# Altium schematic sheet SD&Smart Card.SchDoc
size A4; Revision: B.1(PCB.SCH)
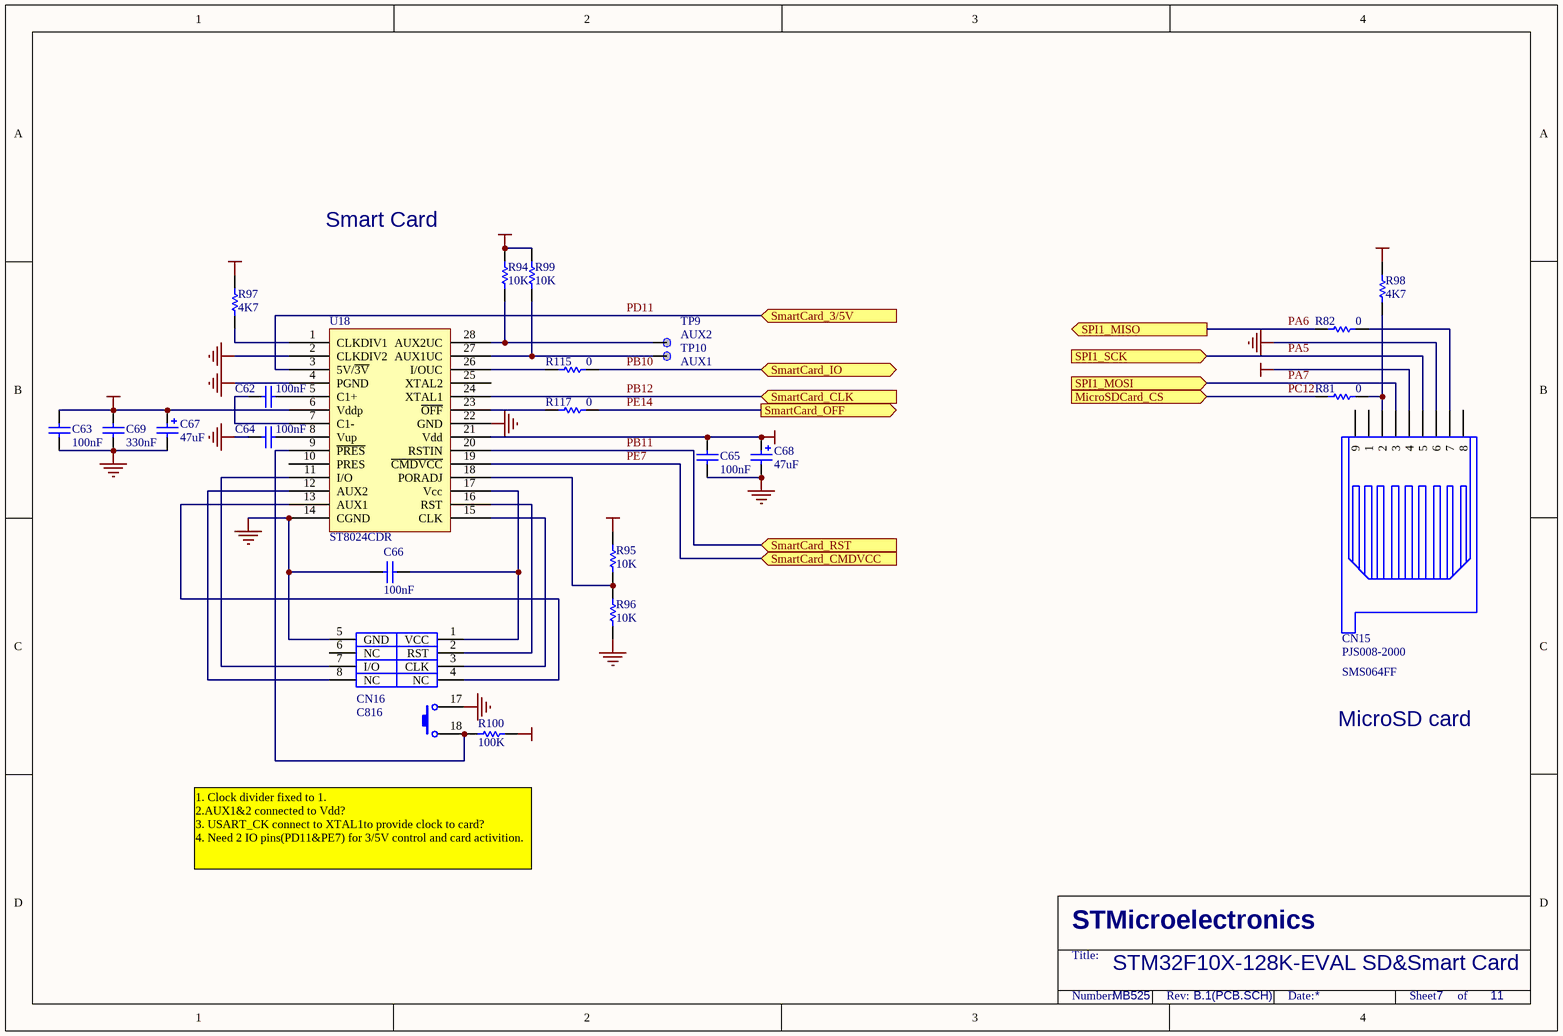
[diagram p0: SD&Smart Card.SchDoc]

## Parts
C62  100nF  [0603P]
C63  100nF  [0603P]
C64  100nF  [0603P]
C65  100nF  [0603P]
C66  100nF  [0603P]
C67  47uF  [TAN-B]
C68  47uF  [TAN-B]
C69  330nF  [0603]
CN15  PJS008-2000  [MSD(PJS008)]
CN16  C816  [SAM(C816)]
R81  0  [0805]
R82  0  [0805]
R94  10K  [0603]
R95  10K  [0603]
R96  10K  [0603]
R97  4K7  [0603]
R98  4K7  [0603]
R99  10K  [0603]
R100  100K  [0603]
R115  0  [0805]
R117  0  [0805]
TP9  AUX2  [TP]
TP10  AUX1  [TP]
U18  ST8024CDR  [SO28]

## Ports
MicroSDCard_CS (in), SmartCard_3/5V (in), SmartCard_CLK (in), SmartCard_CMDVCC (in), SmartCard_IO (bidir), SmartCard_OFF (out), SmartCard_RST (in), SPI1_MISO (out), SPI1_MOSI (in), SPI1_SCK (in)

## Nets
+3V3: C65.1 C68.1 CN15.4 R94.1 R95.1 R97.1 R98.2 R99.1 R100.1 U18.21(Vdd)
+5V: C63.1 C67.1 C69.1 U18.6(Vddp)
GND: C63.2 C64.2 C65.2 C66.1 C67.2 C68.2 C69.2 CN15.6 CN16.5(GND) CN16.17 R96.2 U18.2(CLKDIV2) U18.4(PGND) U18.14(CGND) U18.22(GND)
PA5: CN15.5 ; port SPI1_SCK
PA6: R82.1 ; port SPI1_MISO
PA7: CN15.3 ; port SPI1_MOSI
PB10: R115.2 ; port SmartCard_IO
PB11: U18.20(RSTIN) ; port SmartCard_RST
PB12: U18.24(XTAL1) ; port SmartCard_CLK
PC12: R81.2 ; port MicroSDCard_CS
PD11: U18.3(5V/~{3V}) ; port SmartCard_3/5V
PE7: U18.19(~{CMDVCC}) ; port SmartCard_CMDVCC
PE14: R117.1 ; port SmartCard_OFF
NetC62_1: C62.1 U18.7(C1-)
NetC62_2: C62.2 U18.5(C1+)
NetC64_1: C64.1 U18.8(Vup)
NetC66_2: C66.2 CN16.1(VCC) U18.17(Vcc)
NetCN15_2: CN15.2 R81.1 R98.1
NetCN15_7: CN15.7 R82.2
NetCN16_2: CN16.2(RST) U18.16(RST)
NetCN16_3: CN16.3(CLK) U18.15(CLK)
NetCN16_4: CN16.4(NC) U18.13(AUX1)
NetCN16_7: CN16.7(I/O) U18.11(I/O)
NetCN16_8: CN16.8(NC) U18.12(AUX2)
NetCN16_18: CN16.18 R100.2 U18.9(~{PRES})
NetR94_2: R94.2 TP9.1 U18.28(AUX2UC)
NetR95_2: R95.2 R96.1 U18.18(PORADJ)
NetR97_2: R97.2 U18.1(CLKDIV1)
NetR99_2: R99.2 TP10.1 U18.27(AUX1UC)
NetR115_1: R115.1 U18.26(I/OUC)
NetR117_2: R117.2 U18.23(~{OFF})

Not connected (* = marked no-connect by the designer): CN15 1 8 9; CN16 6(NC); U18 10(PRES) 25(XTAL2)

## Notes on the sheet
- Smart Card
- SMS064FF
- MicroSD card
- 1. Clock divider fixed to 1.
  2.AUX1&2 connected to Vdd?
  3. USART_CK connect to XTAL1to provide clock to card?
  4. Need 2 IO pins(PD11&PE7) for 3/5V control and card activition.
- STM32F10X-128K-EVAL SD&Smart Card
- MB525
- 7
- 11
- STMicroelectronics
- Title:
- Number:
- Rev:
- Date:
- Sheet       of

## Library data of the parts
C62-C66 = CAP: Capacitor; Published: 8-Jun-2000; Revision: July-2002: Re-released for DXP Platform.; Publisher: Altium Limited; Value: 100nF
C67 C68 = Cap Pol1: Polarized Capacitor (Radial); Value: 100pF; Published: 8-Jun-2000; Revision: July-2002: Re-released for DXP Platform.; Publisher: Altium Limited
C69 = CAP: Capacitor; Value: 100nF; Published: 8-Jun-2000; Revision: July-2002: Re-released for DXP Platform.; Publisher: Altium Limited
CN15 = SMS016AFA5E
CN16 = Smart_card_CN
R81 R82 R94-R100 R115 R117 = Res1: Resistor; Value: 1K; Published: 8-Jun-2000; Revision: July-2002: Re-released for DXP Platform.; Publisher: Altium Limited
TP9 TP10 = TP
U18 = ST8024CTR